# Altium schematic sheet Power Reg.SchDoc
size A4; SheetNumber: 3; SheetTotal: 3
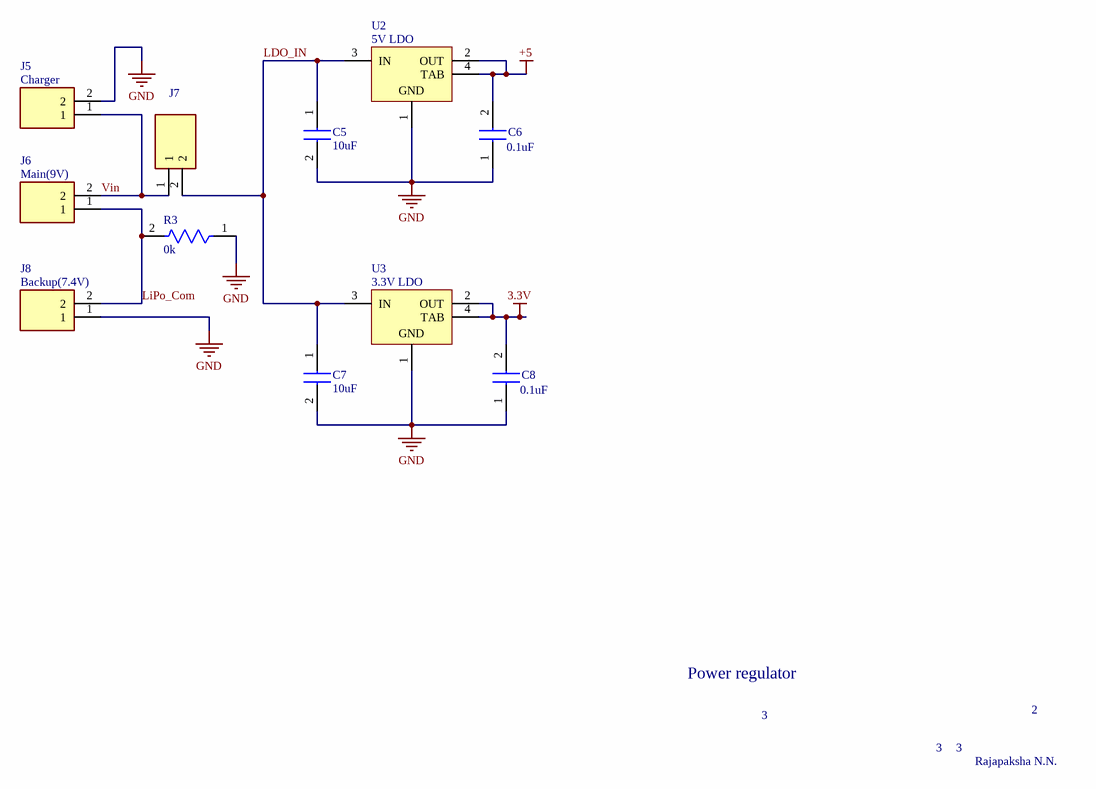
[diagram p0: Power Reg.SchDoc]

## Parts
C5  10uF  [CAPC3216X180N]
C6  value 0.1uF  [C0805]  (hidden comment: C0805R104J5RACTU)
C7  10uF  [CAPC3216X180N]
C8  value 0.1uF  [C0805]  (hidden comment: C0805R104J5RACTU)
J5  value Charger  [1727010]  (hidden comment: 1727010)
J6  value Main(9V)  [1727010]  (hidden comment: 1727010)
J7  1727010  [1727010]  (value not drawn)
J8  value Backup(7.4V)  [1727010]  (hidden comment: 1727010)
R3  0k  [FP-RK73H2A-IPC_C]
U2  value 5V LDO  [DCY0004A_L]  (hidden comment: LM1117MPX-5.0/NOPB)
U3  value 3.3V LDO  [DCY0004A_L]  (hidden comment: LM1117MPX-3.3/NOPB)

## Nets
3.3V: C8.2 U3.2(OUT) U3.4(TAB)
+5: C6.2 U2.2(OUT) U2.4(TAB)
GND: C5.2 C6.1 C7.2 C8.1 J5.2 J8.1 R3.1 U2.1(GND) U3.1(GND)
LDO_IN: C5.1 C7.1 J7.2 U2.3(IN) U3.3(IN)
LiPo_Com: J6.1 J8.2 R3.2
Vin: J5.1 J6.2 J7.1

## Notes on the sheet
- Power regulator
- 3
- 2
- Rajapaksha N.N.

## Library data of the parts
C5 C7 = GRT31CR71E106KE13L: Capacitor; Manufacturer_Name: Murata Electronics; Datasheet Link: https://psearch.en.murata.com/capacitor/product/GRT31CR71E106KE13%23.html; Height: 1.8mm; Manufacturer_Part_Number: GRT31CR71E106KE13L; Mouser Part Number: 81-GRT31CR71E106KE3L; Mouser Price/Stock: https://www.mouser.co.uk/ProductDetail/Murata-Electronics/GRT31CR71E106KE13L?qs=qkDYIeTQ%252BEltpBe08x6bHQ%3D%3D
C6 C8 = C0805R104J5RACTU: Capacitor; Manufacturer_Name: KEMET; Datasheet Link: https://content.kemet.com/datasheets/KEM_C1075_X7R_HT_SMD.pdf; Height: 1.1mm; Manufacturer_Part_Number: C0805R104J5RACTU; Mouser Part Number: 80-C0805R104J5RACTU; Mouser Price/Stock: https://www.mouser.co.uk/ProductDetail/KEMET/C0805R104J5RACTU?qs=RcG8xmE7yp2JeihV4l474Q%3D%3D
J5-J8 = 1727010: Connector; Manufacturer_Name: Phoenix Contact; Datasheet Link: https://datasheet.datasheetarchive.com/originals/distributors/SFDatasheet-2/sf-00050638.pdf; Height: 8.65mm; Manufacturer_Part_Number: 1727010; Mouser Part Number: 651-1727010; Mouser Price/Stock: https://www.mouser.co.uk/ProductDetail/Phoenix-Contact/1727010?qs=JcjeNNoqGSMjtHhQoBJ7UA%3D%3D; Arrow Part Number: 1727010; Arrow Price/Stock: https://www.arrow.com/en/products/1727010/phoenix-contact?region=nac
R3 = CMP-04015-088604-1: 10kΩ ±1% 0.25W Chip Resistor 0805 Thick Film AEC-Q200 Qualified; Resistance: 10kR; Voltage Rating: 150V; Temperature Coefficient: 100ppm/°C; Power Rating: 125mW; Packaging: Tape and Reel; Case Code (Imperial): 0805; Min Operating Temperature: -55°C; Height: 0.5mm; Construction: Rectangular; Tolerance: 1%; Termination: SMD/SMT; Case Code (Metric): 2012; Max Operating Temperature: 155°C; Package Quantity: 10000; RoHS Compliant: Yes; Lead Free: Lead Free; Series: RK73H; Depth: 1.25mm; Case/Package: 0805; Length: 2mm; Width: 1.25mm; Resistor Type: Thick Film; Military Standard: Not
U2 = CMP-0062-01635-4: 800mA Low-Dropout Linear Regulator, 4-pin SOT-223, Pb-Free; Manufacturer: Texas Instruments; PowerWise: N; High-Reliability: Y; PackageTopMarking: XYTT*N06A; CompType: LDO IC; PartNumber: LM1117MPX-5.0/NOPB; Code_JEDEC: TO-261-AA; Code_IPC: SOT223-4; ComponentLink1URL: http://www.ti.com/general/docs/lit/getliterature.tsp?genericPartNumber=LM1117-N&fileType=pdf; PinCount: 4; PackageReference: DCY0004A; ComponentLink1Description: Datasheet URL; PackageDescription: Molded SOT-223, 6.50 x 3.56 x 1.6mm Body, 4 Lead, 2.3mm Pitch; RoHS: Y
U3 = CMP-0062-01639-4: 800mA Low-Dropout Linear Regulator, 4-pin SOT-223, Pb-Free; Manufacturer: Texas Instruments; High-Reliability: Y; PowerWise: N; PackageTopMarking: XYTT*N05A; CompType: LDO IC; ComponentLink1URL: http://www.ti.com/general/docs/lit/getliterature.tsp?genericPartNumber=LM1117-N&fileType=pdf; PartNumber: LM1117MPX-3.3/NOPB; ComponentLink1Description: Datasheet URL; PinCount: 4; Code_JEDEC: TO-261-AA; PackageDescription: Molded SOT-223, 6.50 x 3.56 x 1.6mm Body, 4 Lead, 2.3mm Pitch; PackageReference: DCY0004A; RoHS: Y; Code_IPC: SOT223-4